# Altium schematic sheet BuckConverter.SchDoc
size A4; ApprovedBy: M.Taha@nu.edu.eg; Author: Mazen Ahmed Taha; CompanyName: I'D Tech; Engineer: Mazen Ahmed Taha; Organization: NilePreneurs; Address1: Nile University; Address2: 26th of July Corridor; Address3: Sheikh Zayed City; Address4: Giza, 12588, Egypt; SheetNumber: 8; SheetTotal: 8
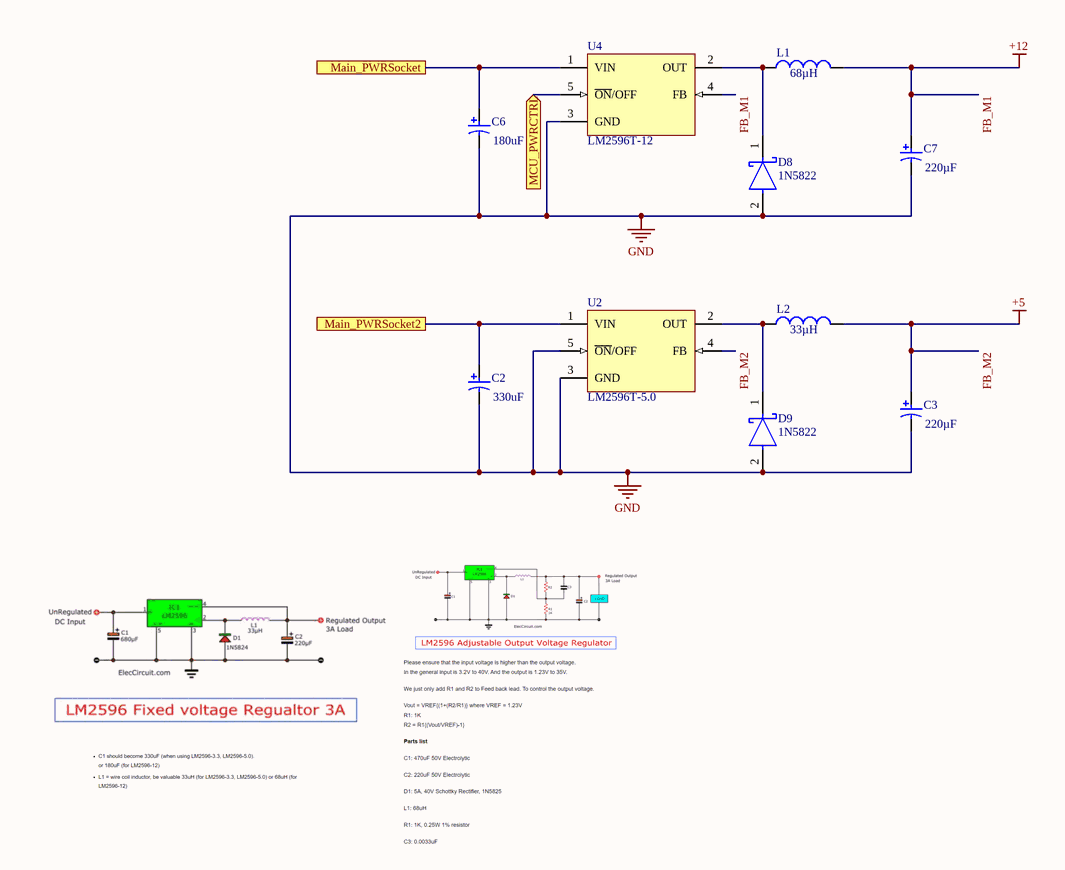
[diagram p0: BuckConverter.SchDoc]

## Parts
C2  Capacitance: 330uF  [PNSC-SVP-F8_L]  (hidden comment: 16SVP180MX)
C3  Capacitance: 220µF  [PNSC-EEUFM1H221-2]  (hidden comment: EEU-FM1H221)
C6  Capacitance: 180uF  [PNSC-SVP-F8_L]  (hidden comment: 16SVP180MX)
C7  Capacitance: 220µF  [PNSC-EEUFM1H221-2]  (hidden comment: EEU-FM1H221)
D8  1N5822  [FP-DO-201AD-MFG]
D9  1N5822  [FP-DO-201AD-MFG]
L1  Inductance: 68µH  [CAPA81-2290X1140_V]  (hidden comment: AIAP-03-220K)
L2  Inductance: 33µH  [CAPA81-2290X1140_V]  (hidden comment: AIAP-03-220K)
U2  LM2596T-5.0  [NDH0005A]
U4  LM2596T-12  [T05D]

## Ports
Main_PWRSocket, Main_PWRSocket2, MCU_PWRCTRL (in)

## Nets
FB_M1: C7.1 L1.2 U4.4(FB)  [also labelled +12]
FB_M2: C3.1 L2.2 U2.4(FB)  [also labelled +5]
GND: C2.2 C3.2 C6.2 C7.2 D8.2(A) D9.2(A) U2.3(GND) U2.5(~{ON}/OFF) U4.3(GND)
Main_PWRSocket: C6.1 U4.1(VIN) ; port Main_PWRSocket
Main_PWRSocket2: C2.1 U2.1(VIN) ; port Main_PWRSocket2
MCU_PWRCTRL: U4.5(~{ON}/OFF) ; port MCU_PWRCTRL
NetD8_1: D8.1(C) L1.1 U4.2(OUT)
NetD9_1: D9.1(C) L2.1 U2.2(OUT)

## Notes on the sheet
- Document Name.PCB Design
- Code : ES-OP-01-F04
- Issue/Rev.
- Issue Date
- 28 Feb. 2022
- 01/01
- Title
- Size:
- Date:
- A4
- Number:
- Time:
- Revision:
- Sheet
- of
- 26th of July Corridor
- I'D Tech
- Nile University
- Sheikh Zayed City
- Giza, 12588, Egypt
- Rev. Date

## Library data of the parts
C2 C6 = CMP-2000-05493-1: Conductive Polymer Aluminum Solid Capacitor, 180 uF, +/- 20%, 16 V, -55 to 105 degC, 2-Pin SMD (F8), RoHS, Tape and Reel; Manufacturer: Panasonic; Voltage: 16VDC; ESR: 30mOhm; Product Height (mm): 7.9mm; Product Diameter (mm): 10mm; Ripple Current: 3.02A; Product Length (mm): NotRequiredmm; Lifetime: 2000hr; Type: OS-CON; DCL: 576uA; Manufacturer URL: http://www.panasonic.com/; Mounting Technology: SurfaceMount; Package Description: 2-Pin Surface Mount Device, Body 10.3 x 10.3 mm; Packaging: TapeandReel; Construction: Cylindrical; Datasheet Version: 11/2015; Package Reference: SVP-F8; Lead Spacing (nom): NotRequiredmm; Datasheet URL: https://industrial.panasonic.com/cdbs/www-data/pdf/AAB8000/AAB8000C193.pdf; Mounting Style: SurfaceMount; Failure Rate: NotRequired; Product Depth (mm): NotRequiredmm; Tolerance (+ or -): 20%; Seated Plane Height: NotRequiredmm; Size (mm): 10X7.9mm; Operating Temp Range: -55Cto105C; Lead Diameter (nom): NotRequiredmm
C3 C7 = CMP-2000-05312-1: Radial Lead Aluminum Electrolytic Capacitor, 220 uF, +/- 20%, 50 V, -40 to 105 degC, RoHS, Bulk; Manufacturer: Panasonic; Rated Voltage: 50V; Impedance: 0.03O; Ripple Current: 1650mA; Lifetime@Temperature: 4000Hrs@105degC; Datasheet Version: May-14; Manufacturer URL: http://www.panasonic.com/; Operating Temp Range: -40to+105degC; Datasheet URL: https://datasheet.ciiva.com/11779/0900766b805f3abe-11779695.pdf; Operating Temp-Max: 105degC; Series: FM; Type: Radial; Case Size/Dimension: Ø10x16mm
D8 D9 = CMP-12187-000025-1: DIODE SCHOTTKY 40V 3A DO201AD; Manufacturer: STMicroelectronics; Max Junction Temp: +150°C; Peak Reverse Current: 2mA; Max Surge Forward Current: 80A; Temperature Range High: +150°C; Automotive: No; RoHS: TRUE; ComponentLink2Description: Datasheet; Manufacturer Part Number: 1N5822; Lead Free: Yes; Octopart: https://octopart.com/1n5822-stmicroelectronics-323225; Device Class L2: Diodes; Max Repetitive Reverse Voltage: 40V; Temperature: to +150°C; Height: 5.3mm; Category: Diode; Digikey Description: DIODE SCHOTTKY 40V 3A DO201AD; ComponentLink2URL: https://www.st.com/resource/en/datasheet/1n5822.pdf; Device Class L3: Schottky Diodes; Device Class L1: Discrete Semiconductors; Forward Current: 3A; Mouser Description: Schottky Diodes & Rectifiers Vr/40V Io/3A BULK; Package: DO-201AD
L1 L2 = CMP-2000-05083-1: Axial Power Inductor, 22 uH, +/- 10%, -55 to 125 degC, 2-Pin THD, RoHS, Bulk; Manufacturer: Abracon; Type: Wirewound; Current Rating: 6.07A; DC Resistance (DCR): 26mOhmMax; Frequency - Test: 1kHz; Shielding: Unshielded; Frequency - Self Resonant: -; Series: AIAP-03; Package Reference: CAPA81-2290X1140; Ratings: -; Q @ Freq: -; Package Description: 2-Pin Axial Lead, Dia 11.4 mm, Body Length 22.9 mm; Operating Temperature: -55degC~125degC; Datasheet URL: http://datasheet.octopart.com/AIAP-03-220K-Abracon-datasheet-38892904.pdf; Family: FixedInductors; Mounting Type: ThroughHole; Datasheet Version: Jan-12; Current - Saturation: -; Packaging: Bulk; Category: Inductors,Coils,Chokes; Size / Dimension: 0.450"Diax0.900"L(11.40mmx22.90mm); Material - Core: -; Tolerance: ±10%; Manufacturer URL: http://www.abracon.com/; Package / Case: Axial; Height - Seated (Max): -
U2 = CMP-0069-01931-3: SIMPLE SWITCHER® Power Converter 150 KHz 3A Step-Down Voltage Regulator, 5-pin TO-220; Manufacturer: Texas Instruments; PackageTopMarking: NSUZXYTTE#*LM2596T*-5.0 P+; PowerWise: N; RoHS: N; ComponentLink1URL: http://www.ti.com/general/docs/lit/getliterature.tsp?genericPartNumber=LM2596&fileType=pdf; PackageReference: NDH0005A; CompType: Switcher; ComponentLink1Description: Datasheet URL; PackageDescription: TO-220, Molded, Stagger Bend, 5 Lead; PinCount: 5
U4 = CMP-0069-01921-2: SIMPLE SWITCHER® Power Converter 150 KHz 3A Step-Down Voltage Regulator, 5-pin TO-220; Manufacturer: National Semiconductor; PowerWise: N; PackageTopMarking: NSUZXYTTE#*LM2596T*-12 P+; PackageDescription: TO-220, Molded, Stagger Bend, 5 Lead; ComponentLink1Description: LM2596 Datasheet; ComponentLink1URL: http://www.national.com/ds/LM/LM2596.pdf; RoHS: N; CompType: Switcher; ComponentLink3Description: T05D Package Page; RevisionNote: Component URLs added; PackageReference: T05D; DatasheetVersion: May-2002; PinCount: 5; ComponentLink2URL: http://www.national.com/pf/LM/LM2596.html; PackageVersion: revA, Oct-1989; ComponentLink3URL: http://www.national.com/packaging/folders/t05d.html; ComponentLink2Description: LM2596 Web Page